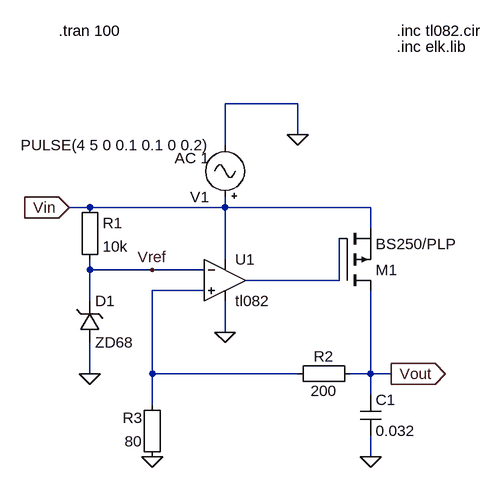
[diagram p0: schematic 10_1_TW_Lösungsvorschlag.asc]
10_1_TW_Lösungsvorschlag.asc, the LTspice schematic file:
Version 4
SHEET 1 1156 680
WIRE 240 -16 128 -16
WIRE 240 32 240 -16
WIRE 128 48 128 -16
WIRE -80 144 -112 144
WIRE 128 144 128 128
WIRE 128 144 -80 144
WIRE 352 144 128 144
WIRE 352 176 352 144
WIRE 128 224 128 144
WIRE -80 240 -80 224
WIRE 16 240 -80 240
WIRE 96 240 16 240
WIRE 304 256 304 192
WIRE 304 256 160 256
WIRE 96 272 16 272
WIRE -80 288 -80 240
WIRE 128 336 128 288
WIRE -80 400 -80 352
WIRE 16 400 16 272
WIRE 240 400 16 400
WIRE 352 400 352 272
WIRE 352 400 320 400
WIRE 384 400 352 400
WIRE 352 432 352 400
WIRE 16 448 16 400
WIRE 352 528 352 496
FLAG 240 32 0
FLAG 16 528 0
FLAG 352 528 0
FLAG 128 336 0
FLAG -80 400 0
FLAG 384 400 Vout
IOPIN 384 400 Out
FLAG -112 144 Vin
IOPIN -112 144 In
FLAG 16 240 Vref
SYMBOL Misc\\signal 128 144 R180
WINDOW 123 24 76 Left 2
WINDOW 39 24 48 Left 2
SYMATTR Value2 AC 1
SYMATTR InstName V1
SYMATTR Value PULSE(4 5 0 0.1 0.1 0 0.2)
SYMBOL Misc\\EuropeanResistor -96 128 R0
SYMATTR InstName R1
SYMATTR Value 10k
SYMATTR SpiceLine tol=1 pwr=0.1
SYMBOL Misc\\EuropeanResistor 336 384 R90
WINDOW 0 5 56 VBottom 2
WINDOW 3 27 56 VTop 2
SYMATTR InstName R2
SYMATTR Value 200
SYMATTR SpiceLine tol=1 pwr=0.1
SYMBOL Misc\\EuropeanResistor 32 544 R180
WINDOW 0 31 76 Left 2
WINDOW 3 31 40 Left 2
SYMATTR InstName R3
SYMATTR Value 80
SYMATTR SpiceLine tol=1 pwr=0.1
SYMBOL zener -96 352 M180
WINDOW 0 24 64 Left 2
WINDOW 3 24 0 Left 2
SYMATTR InstName D1
SYMATTR Value ZD68
SYMBOL pmos 304 272 M180
SYMATTR InstName M1
SYMATTR Value BS250/PLP
SYMATTR Prefix X
SYMBOL Opamps\\opamp2 128 192 R0
SYMATTR InstName U1
SYMATTR Value tl082
SYMBOL cap 336 432 R0
SYMATTR InstName C1
SYMATTR Value 0.032
TEXT -128 -128 Left 2 !.tran 100
TEXT 392 -128 Left 2 !.inc tl082.cir
TEXT 392 -104 Left 2 !.inc elk.lib

The netlist it stands for:
* 10_1_TW_Lösungsvorschlag.asc
V1 Vin 0 PULSE(4 5 0 0.1 0.1 0 0.2) AC 1
R1 Vin Vref 10k tol=1 pwr=0.1
R2 Vout N002 200 tol=1 pwr=0.1
R3 0 N002 80 tol=1 pwr=0.1
D1 0 Vref ZD68
XM1 Vout N001 Vin BS250/PLP  ; pins D G S
XU1 N002 Vref Vin 0 N001 tl082  ; pins In+ In- V+ V- OUT
C1 Vout 0 0.032
.model D D
.lib standard.dio
.tran 100
.inc tl082.cir
.inc elk.lib
.backanno
.end